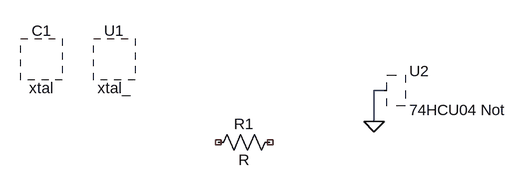
[diagram p0: schematic 20 - Missing Comp.asc]
20 - Missing Comp.asc, the LTspice schematic file:
Version 4.1
SHEET 1 880 680
WIRE -192 496 -208 496
WIRE -208 544 -208 496
FLAG -208 544 0
SYMBOL Misc\\xtal -720 448 R0
SYMATTR InstName C1
SYMBOL TCLib\\Special\\xtal_ -608 448 R0
SYMATTR InstName U1
SYMBOL TCLib\\Special\\74HCU04\ Not -144 432 R0
SYMATTR InstName U2
SYMBOL res -352 560 R90
WINDOW 0 3 56 VBottom 2
WINDOW 3 27 56 VTop 2
SYMATTR InstName R1

The netlist it stands for:
* 20 - Missing Comp.asc
* C1: xtal (symbol Misc\xtal not available, pin order unknown); nets seen at it: 
* U1: xtal_ (symbol TCLib\Special\xtal_ not available, pin order unknown); nets seen at it: 
* U2: 74HCU04 Not (symbol TCLib\Special\74HCU04 Not not available, pin order unknown); nets seen at it: 0
R1 NC_01 NC_02 R
.backanno
.end